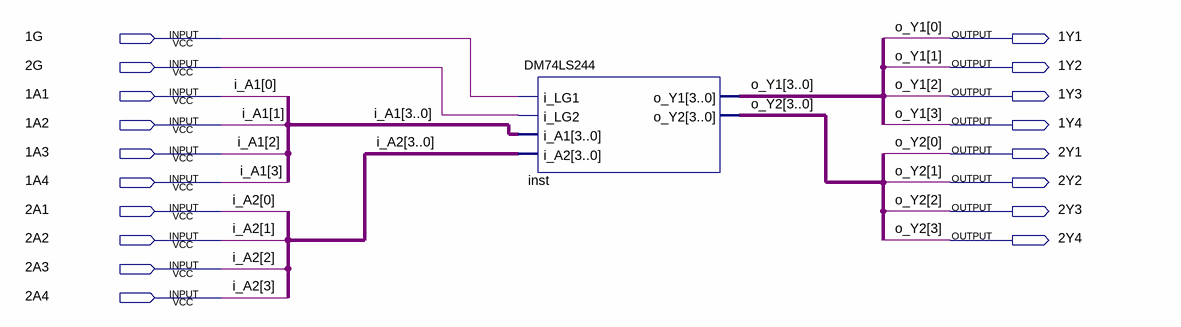
[diagram p0: schematic sheet]
// Quartus schematic DM74LS244_TriState.bdf as structural Verilog: 1 symbols, 18 pins
module DM74LS244_TriState (
  input  \1G ,
  input  \2G ,
  input  \1A1 ,
  input  \1A2 ,
  input  \1A3 ,
  input  \1A4 ,
  input  \2A1 ,
  input  \2A2 ,
  input  \2A3 ,
  input  \2A4 ,
  output \1Y1 ,
  output \1Y2 ,
  output \1Y3 ,
  output \1Y4 ,
  output \2Y1 ,
  output \2Y2 ,
  output \2Y3 ,
  output \2Y4 
);

  DM74LS244 inst (
    .i_LG1(\1G ), .i_LG2(\2G ), .i_A1({\1A4 , \1A3 , \1A2 , \1A1 }), .i_A2({\2A4 , \2A3 , \2A2 , \2A1 }),
    .o_Y1({\1Y4 , \1Y3 , \1Y2 , \1Y1 }), .o_Y2({\2Y4 , \2Y3 , \2Y2 , \2Y1 }));

  // Other names for the same wires on the sheet: i_A1[3:0] = {\1A4 , \1A3 , \1A2 , \1A1 };
  //   i_A2[3:0] = {\2A4 , \2A3 , \2A2 , \2A1 }; o_Y1[3:0] = {\1Y4 , \1Y3 , \1Y2 , \1Y1 };
  //   o_Y2[3:0] = {\2Y4 , \2Y3 , \2Y2 , \2Y1 }
endmodule
